# Altium schematic sheet Main.SchDoc
size A4
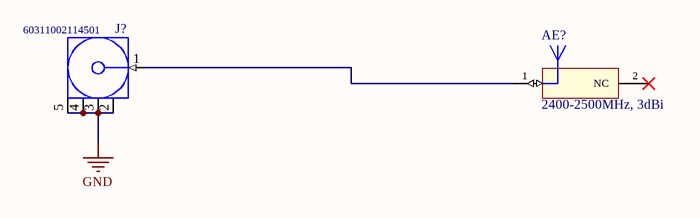
[diagram p0: Main.SchDoc]

## Parts
AE?  2400-2500MHz, 3dBi  [7488910245]
J?  60311002114501  [60311002114501]

## Nets
GND: J?.2(GND) J?.3(GND) J?.4(GND) J?.5(GND)
NetAE?_1: AE?.1(Feed) J?.1(Signal)

Not connected (* = marked no-connect by the designer): AE? 2(NC)*

## Library data of the parts
AE? = 7488910245: WE-MCA SMT Multilayer Chip Antenna, size 9.5x2mm, 2400-2500MHz, 3dBi; Power Capacity: 3W; VSWR: 2; Average Gain: 1dBi; ComponentLink1Description: Manufacturer; ComponentLink1URL: http://www.we-online.de; ComponentLink2Description: Datasheet; ComponentLink2URL: https://katalog.we-online.com/pbs/datasheet/7488910245.pdf; Published Date: July 2019; Publisher: Wurth Elektronik; Size: 9.5x2mm; Mounting Technology: SMT; Frequency Range: 2400-2500MHz; Part Number: 7488910245; Packaging: Tape and Reel; Peak Gain: 3dBi; Operating Temperature: -40 to +85degC
J? = 60311002114501: WR-SMA PCB Jack, THT, Right Angle; Impedance: 50Ohm; Connector Type: SMA; Frequency Range: DC~18GHz; Interface: MIL-STD-348; Center Contact Diameter: 1.27mm; ComponentLink1Description: Manufacturer; ComponentLink1URL: http://www.we-online.de; ComponentLink2Description: Datasheet; ComponentLink2URL: https://katalog.we-online.com/em/datasheet/60311002114501.pdf; Part Number: 60311002114501; Published Date: May 2019; Publisher: Wurth Elektronik; Operating Temperature: -65 to +165degC; Gender: Jack; Packaging: Tray; Mounting Technology: THT; Orientation Type: Right Angle